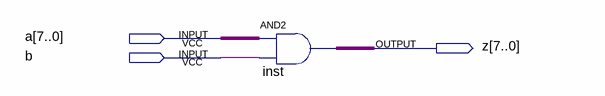
[diagram p0: schematic sheet]
// Quartus schematic MULT_8x1.bdf as structural Verilog: 1 symbols, 3 pins
module MULT_8x1 (
  input  [7:0] a,
  input  b,
  output [7:0] z
);

  assign z = a & {8{b}};  // AND2 inst, 8 bits wide
endmodule
